# Altium schematic sheet TT1-1-Top.SchDoc: Top
size A3; SheetNumber: 1; SheetTotal: 1
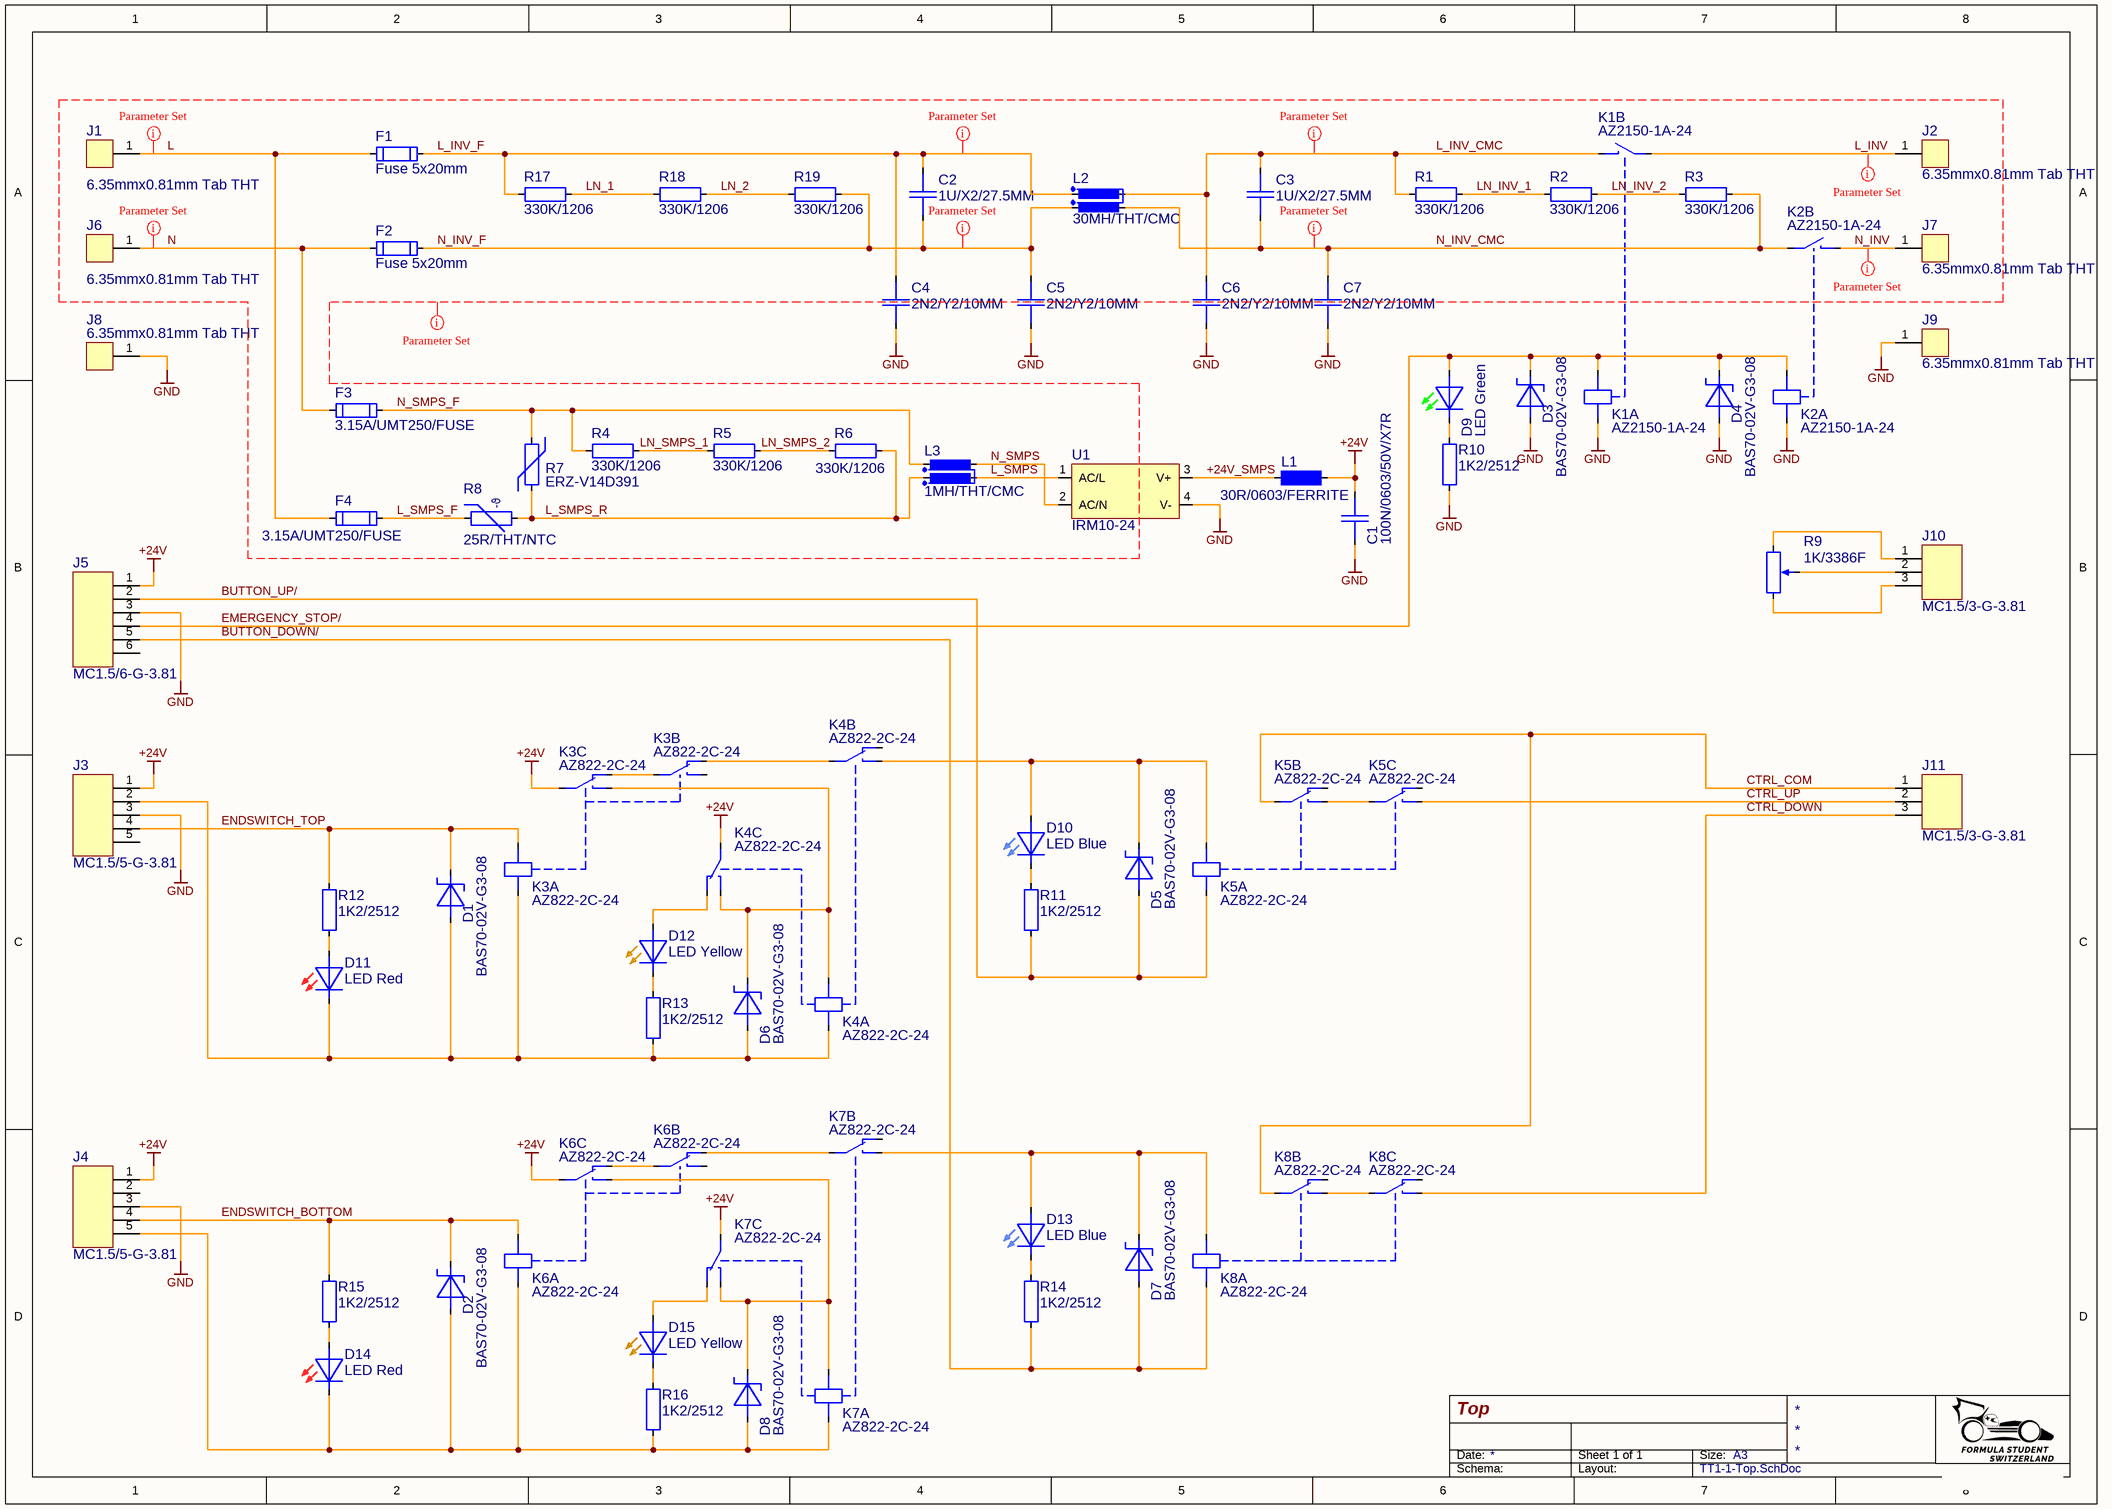
[diagram p0: TT1-1-Top.SchDoc]

## Parts
C1  100N/0603/50V/X7R  [CAP0603_X7R]
C2  1U/X2/27.5MM  [CAP2750P315X110X190-BL]
C3  1U/X2/27.5MM  [CAP2750P315X110X190-BL]
C4  2N2/Y2/10MM  [CAP1000P130X40X90-BL]
C5  2N2/Y2/10MM  [CAP1000P130X40X90-BL]
C6  2N2/Y2/10MM  [CAP1000P130X40X90-BL]
C7  2N2/Y2/10MM  [CAP1000P130X40X90-BL]
D1  BAS70-02V-G3-08  [SOD1608X065]
D2  BAS70-02V-G3-08  [SOD1608X065]
D3  BAS70-02V-G3-08  [SOD1608X065]
D4  BAS70-02V-G3-08  [SOD1608X065]
D5  BAS70-02V-G3-08  [SOD1608X065]
D6  BAS70-02V-G3-08  [SOD1608X065]
D7  BAS70-02V-G3-08  [SOD1608X065]
D8  BAS70-02V-G3-08  [SOD1608X065]
D9  LED Green  [LED0603_GREEN]
D10  LED Blue  [LED0603_BLUE]
D11  LED Red  [LED0603_RED]
D12  LED Yellow  [LED0603_YELLOW]
D13  LED Blue  [LED0603_BLUE]
D14  LED Red  [LED0603_RED]
D15  LED Yellow  [LED0603_YELLOW]
F1  Fuse 5x20mm  [OGN_THR]
F2  Fuse 5x20mm  [OGN_THR]
F3  3.15A/UMT250/FUSE  [UMT250]
F4  3.15A/UMT250/FUSE  [UMT250]
J1  6.35mmx0.81mm Tab THT  [Tab_THT_635]
J2  6.35mmx0.81mm Tab THT  [Tab_THT_635]
J3  MC1.5/5-G-3.81  [MC1.5/5-G-3.81]
J4  MC1.5/5-G-3.81  [MC1.5/5-G-3.81]
J5  MC1.5/6-G-3.81  [MC1.5/6-G-3.81]
J6  6.35mmx0.81mm Tab THT  [Tab_THT_635]
J7  6.35mmx0.81mm Tab THT  [Tab_THT_635]
J8  6.35mmx0.81mm Tab THT  [Tab_THT_635]
J9  6.35mmx0.81mm Tab THT  [Tab_THT_635]
J10  MC1.5/3-G-3.81  [MC1.5/3-G-3.81]
J11  MC1.5/3-G-3.81  [MC1.5/3-G-3.81]
K1  AZ2150-1A-24  [AZ2150-SPST-NO]  (parts A,B of 2)
K2  AZ2150-1A-24  [AZ2150-SPST-NO]  (parts A,B of 2)
K3  AZ822-2C-24  [AZ822]  (parts A,B,C of 3)
K4  AZ822-2C-24  [AZ822]  (parts A,B,C of 3)
K5  AZ822-2C-24  [AZ822]  (parts A,B,C of 3)
K6  AZ822-2C-24  [AZ822]  (parts A,B,C of 3)
K7  AZ822-2C-24  [AZ822]  (parts A,B,C of 3)
K8  AZ822-2C-24  [AZ822]  (parts A,B,C of 3)
L1  30R/0603/FERRITE  [FB0603]
L2  30MH/THT/CMC  [CMC-WE-CMBNC-XL-7448050530]
L3  1MH/THT/CMC  [DFKH-CASE-50-2]
R1  330K/1206  [R1206-0.80-WW]
R2  330K/1206  [R1206-0.80-WW]
R3  330K/1206  [R1206-0.80-WW]
R4  330K/1206  [R1206-0.80-WW]
R5  330K/1206  [R1206-0.80-WW]
R6  330K/1206  [R1206-0.80-WW]
R7  ERZ-V14D391  [RESD750W80D155]
R8  25R/THT/NTC  [RESD500W60D115]
R9  1K/3386F  [3386F]
R10  1K2/2512  [R2512-0.65-WW]
R11  1K2/2512  [R2512-0.65-WW]
R12  1K2/2512  [R2512-0.65-WW]
R13  1K2/2512  [R2512-0.65-WW]
R14  1K2/2512  [R2512-0.65-WW]
R15  1K2/2512  [R2512-0.65-WW]
R16  1K2/2512  [R2512-0.65-WW]
R17  330K/1206  [R1206-0.80-WW]
R18  330K/1206  [R1206-0.80-WW]
R19  330K/1206  [R1206-0.80-WW]
U1  IRM10-24  [IRM10]

## Nets
+24V: C1.1 J3.1 J4.1 J5.1 K3.6(COM2) K4.6(COM2) K6.6(COM2) K7.6(COM2) L1.2
GND: C1.2 C4.2 C5.2 C6.2 C7.2 D3.2 D4.2 J3.3 J4.3 J5.3 J8.1 J9.1 K1.2 K2.2 R10.2 U1.4(V-)
+24V_SMPS: L1.1 U1.3(V+)
BUTTON_DOWN/: D7.2 J5.5 K8.2 R14.2
BUTTON_UP/: D5.2 J5.2 K5.1 R11.2
CTRL_COM: J11.1 K5.3(COM1) K8.3(COM1)
CTRL_DOWN: J11.3 K8.8(NO2)
CTRL_UP: J11.2 K5.8(NO2)
EMERGENCY_STOP/: D3.1 D4.1 D9.2 J5.4 K1.1 K2.1
ENDSWITCH_BOTTOM: D2.1 J4.4 K6.1 R15.1
ENDSWITCH_TOP: D1.1 J3.4 K3.1 R12.1
L: F1.1 F4.1 J1.1
L_INV: J2.1 K1.3(COM1)
L_INV_CMC: C3.1 C6.1 K1.4(NO1) L2.4 R1.1
L_INV_F: C2.1 C4.1 F1.2 L2.2 R17.1
L_SMPS: L3.4 U1.1(AC/L)
L_SMPS_F: F4.2 R8.1
L_SMPS_R: L3.2 R6.2 R7.2 R8.2
LN_1: R17.2 R18.1
LN_2: R18.2 R19.1
LN_INV_1: R1.2 R2.1
LN_INV_2: R2.2 R3.1
LN_SMPS_1: R4.2 R5.2
LN_SMPS_2: R5.1 R6.1
N: F2.1 F3.1 J6.1
N_INV: J7.1 K2.4(NO1)
N_INV_CMC: C3.2 C7.1 K2.3(COM1) L2.3 R3.2
N_INV_F: C2.2 C5.1 F2.2 L2.1 R19.2
N_SMPS: L3.3 U1.2(AC/N)
N_SMPS_F: F3.2 L3.1 R4.1 R7.1
NetD1_2: D1.2 D6.2 D11.1 J3.2 K3.2 K4.2 R13.2
NetD2_2: D2.2 D8.2 D14.1 J4.5 K6.2 K7.2 R16.2
NetD5_1: D5.1 D10.2 K4.5(NO1) K5.2
NetD6_1: D6.1 K3.8(NO2) K4.1 K4.8(NO2)
NetD7_1: D7.1 D13.2 K7.5(NO1) K8.1
NetD8_1: D8.1 K6.8(NO2) K7.1 K7.8(NO2)
NetD9_1: D9.1 R10.1
NetD10_1: D10.1 R11.1
NetD11_2: D11.2 R12.2
NetD12_1: D12.1 R13.1
NetD12_2: D12.2 K4.7(NC2)
NetD13_1: D13.1 R14.1
NetD14_2: D14.2 R15.2
NetD15_1: D15.1 R16.1
NetD15_2: D15.2 K7.7(NC2)
NetJ10_1: J10.1 R9.1
NetJ10_2: J10.2 R9.3
NetJ10_3: J10.3 R9.2
NetK3_3: K3.3(COM1) K3.7(NC2)
NetK3_4: K3.4(NC1) K4.3(COM1)
NetK5_5: K5.5(NO1) K5.6(COM2)
NetK6_3: K6.3(COM1) K6.7(NC2)
NetK6_4: K6.4(NC1) K7.3(COM1)
NetK8_5: K8.5(NO1) K8.6(COM2)

Not connected (* = marked no-connect by the designer): J3 5; J4 2; J5 6; K3 5(NO1); K4 4(NC1); K5 4(NC1) 7(NC2); K6 5(NO1); K7 4(NC1); K8 4(NC1) 7(NC2)

## Layout directives
net class Mains: L, L_INV, L_INV_CMC, L_INV_F, L_SMPS, L_SMPS_F, L_SMPS_R, LN_1, LN_2, LN_INV_1, LN_INV_2, LN_SMPS_1, LN_SMPS_2, N, N_INV, N_INV_CMC, N_INV_F, N_SMPS, N_SMPS_F
net class L: L, L_INV, L_INV_CMC, L_INV_F
net class N: N, N_INV, N_INV_CMC, N_INV_F

## Notes on the sheet
- Date:
- Size:
- A3
- Schema:
- Layout:
- (in symbol 25R/THT/NTC) -ϑ

## Library data of the parts
C1 = 100N/0603/50V/X7R: CAP SM 0603 100nF 50V X7R; Manufacturer: GENERIC; Manufacturer 1: YAGEO; Manufacturer Part Number 1: CC0603KPX7R9BB104; Absolute Value: 1E-7; Eurocircuits GPN: GPC0603104; Part Number: 100N/0603/50V/X7R; Package: 0603; Value: 100nF; HelpURL: https://www.yageo.com/upload/media/product/app/datasheet/mlcc/upy-gphc_x7r_6_3v-to-250v.pdf; Supplier 1: Digi-Key; Supplier Part Number 1: 311-3567-1-ND; Manufacturer 2: YAGEO; Manufacturer Part Number 2: CC0603MRX7R9BB104; Supplier 2: Digi-Key; Supplier Part Number 2: 311-4110-1-ND; Supplier 3: LCSC; Supplier Part Number 3: C14663; JLC Type: Basic
C2 C3 = 1U/X2/27.5MM: CAP THT 31.5X11X19 1uF 305V X2; Manufacturer: GENERIC; Manufacturer 1: EPCOS - TDK Electronics; Manufacturer Part Number 1: B32924C3105K000; Absolute Value: 1E-6; Part Number: 1U/X2/27.5MM; Value: 1UF; HelpURL: https://product.tdk.com/en/system/files?file=dam/doc/product/capacitor/film/emi/data_sheet/20/20/db/fc_2009/x2_b32921_928.pdf; Supplier 1: Digi-Key; Supplier Part Number 1: 495-4209-ND
C4-C7 = 2N2/Y2/10MM: CAP THT 13X4X9 2.2nF 300V Y2; Manufacturer: GENERIC; Manufacturer 1: EPCOS - TDK Electronics; Manufacturer Part Number 1: B32021A3222K000; Absolute Value: 2.2E-9; Part Number: 2N2/Y2/10MM; Value: 2.2nF; HelpURL: https://www.tdk-electronics.tdk.com/inf/20/20/db/fc_2009/Y2_B32021_026.pdf; Supplier 1: Digi-Key; Supplier Part Number 1: 495-4788-ND
D1-D8 = BAS70-02V-G3-08: Small Signal Schottky Diode; Manufacturer: Vishay; Manufacturer 1: Vishay General Semiconductor - Diodes Division; Value: 70V/100mA; Absolute Value: 70V; Part Number: BAS70-02V-G3-08; Package: SOD523; HelpURL: https://www.vishay.com/docs/85652/bas70-02v.pdf; Manufacturer Part Number 1: BAS70-02V-G3-08; Supplier 1: Digikey; Supplier Part Number 1: 112-BAS70-02V-G3-08CT-ND; Manufacturer 3: Vishay Intertech; Manufacturer Part Number 3: BAS70-02V-G3-08; Supplier 3: LCSC; Supplier Part Number 3: C3313114; JLC Type: Extended
D9 = LED Green 0603: Generic LED Green 0603; Manufacturer 1: Würth; Manufacturer Part Number 1: 150060VS75000; Part Number: LED Green 0603; Manufacturer: GENERIC; Package: 603; Value: Green; Absolute Value: Green; HelpURL: https://www.we-online.com/katalog/datasheet/150060VS75000.pdf; Supplier 1: Digikey; Supplier Part Number 1: 732-4980-1-ND; Manufacturer 3: Everlight Elec; Manufacturer Part Number 3: 19-217/GHC-YR1S2/3T; Supplier 3: LCSC; Supplier Part Number 3: C72043; JLC Type: Basic
D10 D13 = LED Blue 0603: Generic LED Blue 0603; Manufacturer 1: Würth; Manufacturer Part Number 1: 150060BS75000; Part Number: LED Blue 0603; Manufacturer: GENERIC; Package: 603; Value: Blue; Absolute Value: Blue; HelpURL: https://www.we-online.com/katalog/datasheet/150060BS75000.pdf; Supplier 1: Digikey; Supplier Part Number 1: 732-4966-1-ND; Manufacturer 3: Everlight Elec; Manufacturer Part Number 3: 19-217/BHC-ZL1M2RY/3T; Supplier 3: LCSC; Supplier Part Number 3: C72041; JLC Type: Basic
D11 D14 = LED Red 0603: Generic LED Red 0603; Manufacturer 1: Würth; Manufacturer Part Number 1: 150060RS75000; Part Number: LED Red 0603; Manufacturer: GENERIC; Package: 603; Value: Red; Absolute Value: Red; HelpURL: https://www.we-online.com/katalog/datasheet/150060RS75000.pdf; Supplier 1: Digikey; Supplier Part Number 1: 732-4978-1-ND; Manufacturer 3: Hubei KENTO Elec; Manufacturer Part Number 3: KT-0603R; Supplier 3: LCSC; Supplier Part Number 3: C2286; JLC Type: Basic
D12 D15 = LED Yellow 0603: Generic LED Yellow 0603; Manufacturer 1: Würth; Manufacturer Part Number 1: 150060YS75000; Part Number: LED Yellow 0603; Manufacturer: GENERIC; Package: 603; Value: Yellow; Absolute Value: Yellow; HelpURL: https://www.we-online.com/components/products/datasheet/150060YS75000.pdf; Supplier 1: Digikey; Supplier Part Number 1: 732-4981-1-ND; Manufacturer 3: Everlight Elec; Manufacturer Part Number 3: 19-213/Y2C-CQ2R2L/3T(CY); Supplier 3: LCSC; Supplier Part Number 3: C72038; JLC Type: Basic
F1 F2 = Fuse/5x20mm/OGN: open fuse holder, 5 x 20 mm, THR, IEC 60335-1; Manufacturer: Schurter; Manufacturer Part Number 1: 3-132-873; Part Number: Fuse/5x20mm/OGN; Package: 5X20; HelpURL: https://www.schurter.com/en/datasheet/typ_OGN.pdf; Manufacturer 1: Schurter; Supplier 1: Digi-Key; Supplier Part Number 1: 486-3-132-873-ND
F3 F4 = 3.15A/UMT250/FUSE: Fuse 250VAC 3.15A UMT250; Manufacturer: Schurter; Manufacturer Part Number 1: 3403.0171.24; Absolute Value: 3.15; Part Number: 3.15A/UMT250/FUSE; Package: UMT250; HelpURL: https://www.schurter.com/en/datasheet/typ_UMT_250.pdf; Manufacturer 1: Schurter; Supplier 1: Digi-Key; Supplier Part Number 1: 486-3482-1-ND; Value: 3.15A
J1 J2 J6-J9 = Tab_025_THT: CONN QC TAB 0.250 SOLDER; Manufacturer: GENERIC; Manufacturer 1: TE Connectivity AMP Connectors; Manufacturer Part Number 1: 1217861-1; Part Number: Tab_025_THT; HelpURL: https://www.te.com/usa-en/product-1217861-1.datasheet.pdf; Supplier 1: Digi-Key; Supplier Part Number 1: A100452CT-ND; Manufacturer 3: TE Connectivity; Manufacturer Part Number 3: 1217861-1; Supplier 3: LCSC; Supplier Part Number 3: C428480
J3 J4 = MC1.5/5-G-3.81: Phoenix contact MC 1,5/ 5-G-3,81; Manufacturer Part Number 1: 1803303; Part Number: MC1.5/5-G-3.81; Manufacturer: Phoenix; HelpURL: https://www.phoenixcontact.com/en-us/products/pcb-header-mc-15-5-g-381-1803303?type=pdf; Manufacturer 1: Phoenix; Supplier 1: Digi-Key; Supplier Part Number 1: 277-1209-ND
J5 = MC1.5/6-G-3.81: Phoenix contact MC 1,5/ 6-G-3,81; Manufacturer Part Number 1: 1803316; Part Number: MC1.5/6-G-3.81; Manufacturer: Phoenix; HelpURL: https://www.phoenixcontact.com/en-us/products/pcb-header-mc-15-6-g-381-1803316?type=pdf; Manufacturer 1: Phoenix; Supplier 1: Digi-Key; Supplier Part Number 1: 277-1210-ND
J10 J11 = MC1.5/3-G-3.81: Phoenix contact MC 1,5/ 3-G-3,81; Manufacturer Part Number 1: 1803280; Part Number: MC1.5/3-G-3.81; Manufacturer: Phoenix; HelpURL: https://www.phoenixcontact.com/en-us/products/pcb-header-mc-15-3-g-381-1803280?type=pdf; Manufacturer 1: Phoenix; Supplier 1: Digi-Key; Supplier Part Number 1: 277-1207-ND
K1 K2 = AZ2150-1A-24: Miniature Power Relay, SPST-NO, 24V Coil, 40A 30VDC 300VAC; Manufacturer: Zettler; Manufacturer 1: American Zettler; Manufacturer Part Number 1: AZ2150-1A-24DEF; Part Number: AZ2150-1A-24; HelpURL: https://www.azettler.com/pdfs/az2150.pdf; Supplier 1: Digi-Key; Supplier Part Number 1: 3385-AZ2150-1A-24DEF-ND
K3-K8 = AZ822-2C-24: Subminiature DIP Relay, DPDT, 24V 98mW Coil, 2A 220VDC 250VAC; Manufacturer: Zettler; Manufacturer 1: American Zettler; Manufacturer Part Number 1: AZ822-2C-24DE; Part Number: AZ822-2C-24; HelpURL: https://www.azettler.com/pdfs/az822.pdf; Supplier 1: Digi-Key; Supplier Part Number 1: 3385-AZ822-2C-24DE-ND
L1 = 30R/0603/FERRITE: 30R@100MHz 5A 0603 Ferrite; Manufacturer: GENERIC; Manufacturer 1: Laird-Signal Integrity Products; Manufacturer Part Number 1: HI0603R300R-10; Value: 30R; Absolute Value: 1000; Part Number: 30R/0603/FERRITE; Package: 603; HelpURL: https://www.laird.com/document/datasheet/hi0603r300r-10-datasheet; Supplier 1: Digi-Key; Supplier Part Number 1: 240-HI0603R300R-10CT-ND
L2 = 30MH/THT/CMC: CMC 30mH 5A Würth CMBNC 7448050530; Manufacturer 1: Würth Elektronik; Absolute Value: 0.03; Part Number: 30MH/THT/CMC; Manufacturer: Würth; Package: CMBNC; Value: 30MH; HelpURL: https://www.we-online.com/components/products/datasheet/7448050530.pdf; Manufacturer Part Number 1: 7448050530; Supplier 1: Digi-Key; Supplier Part Number 1: 732-5596-ND
L3 = 1MH/THT/CMC: CMC 1mH 2A THT Schurter DFKH-14-0003; Manufacturer 1: SCHURTER Inc.; Part Number: 1MH/THT/CMC; Manufacturer: SCHURTER; Package: 15X10.5mm; Value: 1MH; HelpURL: https://www.schurter.com/en/datasheet/typ_DFKH.pdf; Manufacturer Part Number 1: DFKH-14-0003; Supplier 1: Digi-Key; Supplier Part Number 1: 486-3121-ND
R1-R6 R17-R19 = 330K/1206: RES SM 1206 330K; Manufacturer: GENERIC; Manufacturer 1: YAGEO; Manufacturer Part Number 1: RC1206FR-07330KL; Absolute Value: 330000; Part Number: 330K/1206; Package: 1206; Value: 330K; HelpURL: https://www.yageo.com/upload/media/product/products/datasheet/rchip/PYu-RC_Group_51_RoHS_L_12.pdf; Supplier 1: Digi-Key; Supplier Part Number 1: 311-330KFRCT-ND
R7 = ERZ-V14D391: VARISTOR 391V 6kA; Manufacturer: GENERIC; Manufacturer 1: Panasonic Electronic Components; Absolute Value: 391; Part Number: ERZ-V14D391; Package: 7.5mm; Value: 391V; HelpURL: https://industrial.panasonic.com/cdbs/www-data/pdf/AWA0000/AWA0000C1.pdf; Manufacturer Part Number 1: ERZ-V14D391; Supplier 1: Digi-Key; Supplier Part Number 1: P7266-ND
R8 = 25R/THT/NTC: RES NTC THT 5 25R; Manufacturer: GENERIC; Manufacturer 1: EPCOS - TDK Electronics; Manufacturer Part Number 1: B57236S0250M000; Absolute Value: 25; Part Number: 25R/THT/NTC; Package: 5mm; Value: 25R; HelpURL: https://product.tdk.com/system/files/dam/doc/product/protection/current/ntc-limiter/data_sheet/50/db/icl_16/s236.pdf; Supplier 1: Digi-Key; Supplier Part Number 1: 495-3048-ND
R9 = 1K/3386F: RES POT 3386F 1K; Manufacturer: Bourns; Manufacturer 1: Bourns Inc.; Manufacturer Part Number 1: 3386F-1-102TLF; Absolute Value: 1000; Part Number: 1K/3386F; Package: 3386F; Value: 1K; HelpURL: https://www.bourns.com/docs/Product-Datasheets/3386.pdf; Supplier 1: Digi-Key; Supplier Part Number 1: 3386F-1-102TLF-ND
R10-R16 = 1K2/2512: RES SM 2512 1K2; Manufacturer: GENERIC; Manufacturer 1: YAGEO; Manufacturer Part Number 1: RC2512FK-071K2L; Absolute Value: 1200; Eurocircuits GPN: GPR25121K2; Part Number: 1K2/2512; Package: 2512; Value: 1K2; HelpURL: https://www.yageo.com/upload/media/product/products/datasheet/rchip/PYu-RC_Group_51_RoHS_L_12.pdf; Supplier 1: Digi-Key; Supplier Part Number 1: 13-RC2512FK-071K2LCT-ND; Manufacturer 2: YAGEO; Manufacturer Part Number 2: RC2512JK-071K2L; Supplier 2: Digi-Key; Supplier Part Number 2: 13-RC2512JK-071K2LCT-ND
U1 = IRM10-24: 10W AC-DC PCB-Mount Green Power Module, 24V; Manufacturer 1: MEAN WELL USA Inc.; Manufacturer Part Number 1: IRM-10-24; Part Number: IRM10-24; Package: Module; HelpURL: https://www.meanwell-web.com/content/files/pdfs/productPdfs/MW/IRM-10/IRM-10-spec.pdf; Supplier 1: Digi-Key; Supplier Part Number 1: 1866-3030-ND